# Altium schematic sheet USBUART_CP2102.SchDoc
size A3
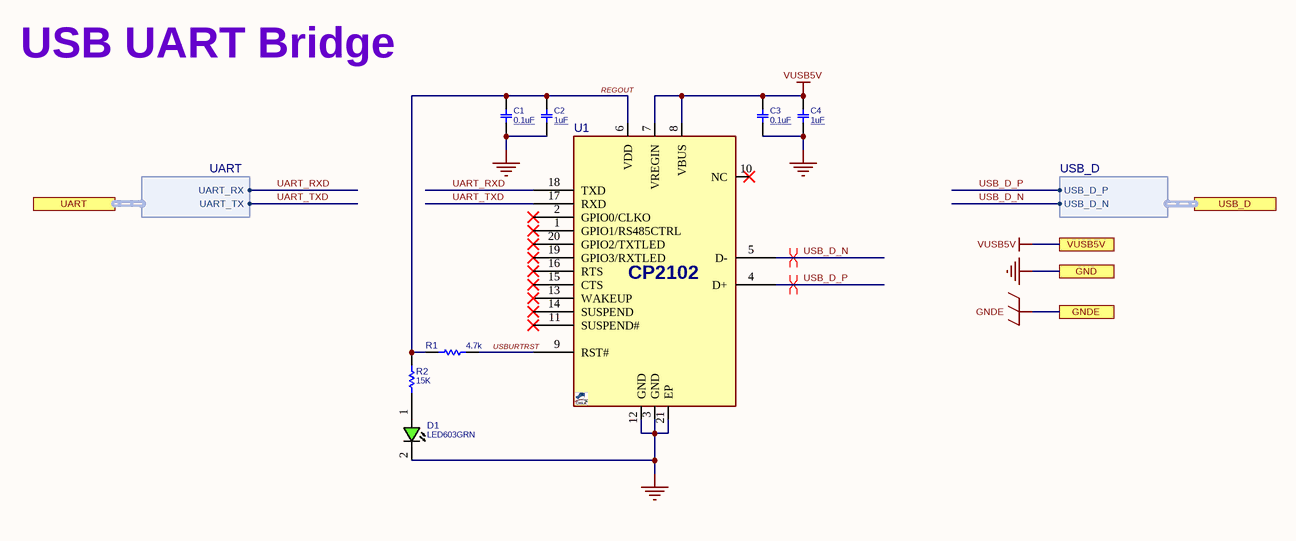
[diagram p0: USBUART_CP2102.SchDoc]

## Parts
C1  0.1uF  [C0402]
C2  1uF  [C0402]
C3  0.1uF  [C0402]
C4  1uF  [C0402]
D1  LED603GRN  [LED0603GRN]
R1  4.7k  [R0402]
R2  15K  [R0402]
U1  CP2102  [QFN50_20T_3X3]  (value not drawn)

## Ports
GND, GNDE, UART (harness UART), USB_D (harness USB_D), VUSB5V

## Harnesses
USB_D: USB_D_P, USB_D_N
UART: UART_RX, UART_TX

## Nets
GND: C1.2 C2.2 C3.2 C4.2 D1.2(CATHODE) U1.3(GND) U1.12(GND) U1.21(EP) ; port GND
GNDE: port GNDE
VUSB5V: C3.1 C4.1 U1.7(VREGIN) U1.8(VBUS) ; port VUSB5V
REGOUT: C1.1 C2.1 R1.2 R2.1 U1.6(VDD)
UART_RXD: U1.18(TXD) ; port UART.UART_RX
UART_TXD: U1.17(RXD) ; port UART.UART_TX
USB_D_N: U1.5(D-) ; port USB_D.USB_D_N
USB_D_P: U1.4(D+) ; port USB_D.USB_D_P
USBURTRST: R1.1 U1.9(RST#)
NetD1_1: D1.1(ANODE) R2.2

Not connected (* = marked no-connect by the designer): U1 1(GPIO1/RS485CTRL)* 2(GPIO0/CLKO)* 10(NC)* 11(SUSPEND#)* 13(WAKEUP)* 14(SUSPEND)* 15(CTS)* 16(RTS)* 19(GPIO3/RXTLED)* 20(GPIO2/TXTLED)*

## Layout directives
differential pair: USB_D_N, USB_D_P

## Notes on the sheet
- USB UART Bridge

## Library data of the parts
C1-C4 = CAP_SMD_MLCC: CAP, MLCC, 1nF, 50V, C0G, 10%, 0402; MANF: Murata; PARAM: C0G, 10%; PRICE: 100= 1.4$; DESC: -; MANF_P#: -; PARAM2: 50V; ASSEMBLY: ASSEMBLY
  C1 C3: VALUE: 0.1uF
  C2 C4: VALUE: 1uF
D1 = LED_SMD_0603_GRN: LED, SMD, 0603, GREEN; PARAM: 20mA; MANF: Kingbright; DESC: DESCRIPTION; MANF_P#: APT1608SGC; PARAM2: 2.2V; ASSEMBLY: ASSEMBLY; PRICE: 1: 0.14$, 100: 6.8$; VALUE: LED603GRN
R1 R2 = RES_SMD: RESISTOR, SMD; PARAM: 0.063W; DESC: DESCRIPTION; DIST#: MOUSER; PARAM2: 1%; MANF_P#: -; MANF: -; ASSEMBLY: ASSEMBLY; PRICE: 100= 0.5$
  R1: VALUE: 4.7k
  R2: VALUE: 15K
U1 = CP2102_QFN20: USB-UART BRIDGE; MANF: SILICON LABS; DESC: DESCRIPTION; MANF_P#: CP2102N-A01-GQFN20; PARAM2: 3.3V; MANF: MANF; ASSEMBLY: ASSEMBLY; PRICE: 1$; VALUE: CP2102